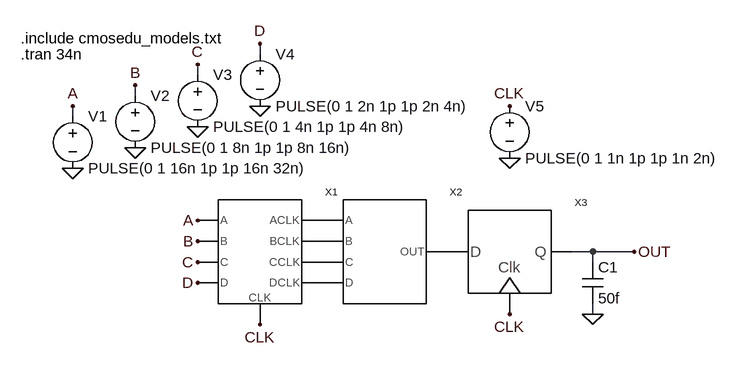
[diagram p0: schematic Circuit.asc]
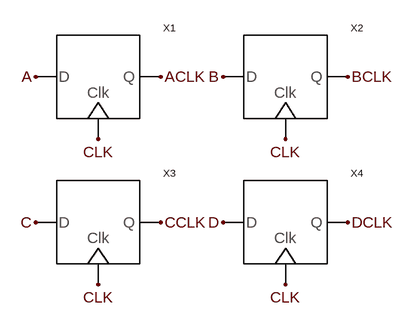
[diagram p1: sub-circuit d_ff4.asc]
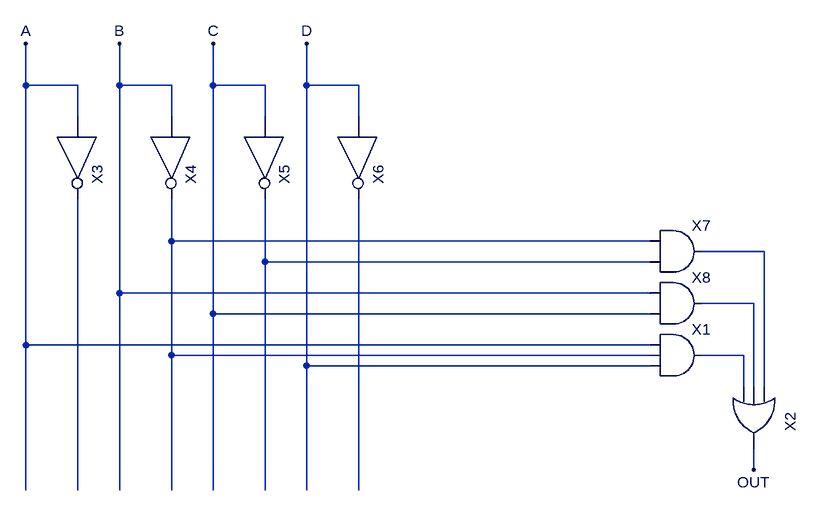
[diagram p2: sub-circuit fonction.asc]
Circuit.asc, the LTspice schematic file:
Version 4
SHEET 1 1228 680
WIRE 304 -96 304 -112
WIRE 208 -64 208 -80
WIRE 112 -32 112 -48
WIRE 16 0 16 -16
WIRE 816 208 784 208
WIRE 880 208 816 208
WIRE 816 224 816 208
WIRE 816 304 816 288
FLAG 112 48 0
FLAG 16 80 0
FLAG 208 16 0
FLAG 304 -16 0
FLAG 16 -16 A
FLAG 112 -48 B
FLAG 208 -80 C
FLAG 304 -112 D
FLAG 208 160 A
FLAG 208 192 B
FLAG 208 224 C
FLAG 208 256 D
FLAG 816 304 0
FLAG 688 64 0
FLAG 688 -16 CLK
FLAG 304 320 CLK
FLAG 688 304 CLK
FLAG 880 208 OUT
SYMBOL D_FF4 304 208 R0
SYMATTR InstName X1
SYMBOL voltage 16 -16 R0
WINDOW 123 0 0 Left 0
WINDOW 39 0 0 Left 0
SYMATTR InstName V1
SYMATTR Value PULSE(0 1 16n 1p 1p 16n 32n)
SYMBOL voltage 112 -48 R0
WINDOW 123 0 0 Left 0
WINDOW 39 0 0 Left 0
SYMATTR InstName V2
SYMATTR Value PULSE(0 1 8n 1p 1p 8n 16n)
SYMBOL voltage 208 -80 R0
WINDOW 123 0 0 Left 0
WINDOW 39 0 0 Left 0
SYMATTR InstName V3
SYMATTR Value PULSE(0 1 4n 1p 1p 4n 8n)
SYMBOL voltage 304 -112 R0
WINDOW 123 0 0 Left 0
WINDOW 39 0 0 Left 0
SYMATTR InstName V4
SYMATTR Value PULSE(0 1 2n 1p 1p 2n 4n)
SYMBOL Fonction 496 208 R0
SYMATTR InstName X2
SYMBOL D_FF 688 208 R0
SYMATTR InstName X3
SYMBOL voltage 688 -32 R0
WINDOW 123 0 0 Left 0
WINDOW 39 0 0 Left 0
SYMATTR InstName V5
SYMATTR Value PULSE(0 1 1n 1p 1p 1n 2n)
SYMBOL cap 800 224 R0
SYMATTR InstName C1
SYMATTR Value 50f
TEXT -64 -120 Left 2 !.include cmosedu_models.txt
TEXT -64 -96 Left 2 !.tran 34n

d_ff4.asc, the sub-circuit schematic file:
Version 4
SHEET 1 880 972
FLAG -144 640 CLK
FLAG 144 640 CLK
FLAG -144 864 CLK
FLAG 144 864 CLK
FLAG -240 544 A
FLAG 48 544 B
FLAG -240 768 C
FLAG 48 768 D
FLAG -48 544 ACLK
FLAG 240 544 BCLK
FLAG -48 768 CCLK
FLAG 240 768 DCLK
SYMBOL D_FF -144 544 R0
SYMATTR InstName X1
SYMBOL D_FF 144 544 R0
SYMATTR InstName X2
SYMBOL D_FF -144 768 R0
SYMATTR InstName X3
SYMBOL D_FF 144 768 R0
SYMATTR InstName X4

fonction.asc, the sub-circuit schematic file:
Version 4
SHEET 1 884 680
WIRE -368 -80 -368 -144
WIRE -288 -80 -368 -80
WIRE -224 -80 -224 -144
WIRE -144 -80 -224 -80
WIRE -80 -80 -80 -144
WIRE 0 -80 -80 -80
WIRE 64 -80 64 -144
WIRE 144 -80 64 -80
WIRE -288 -32 -288 -80
WIRE -144 -32 -144 -80
WIRE 0 -32 0 -80
WIRE 144 -32 144 -80
WIRE -144 160 -144 96
WIRE 592 160 -144 160
WIRE 768 176 672 176
WIRE 0 192 0 96
WIRE 592 192 0 192
WIRE -224 240 -224 -80
WIRE 592 240 -224 240
WIRE 752 256 672 256
WIRE -80 272 -80 -80
WIRE 592 272 -80 272
WIRE -368 320 -368 -80
WIRE 592 320 -368 320
WIRE -144 336 -144 160
WIRE 592 336 -144 336
WIRE 736 336 672 336
WIRE 64 352 64 -80
WIRE 592 352 64 352
WIRE 736 384 736 336
WIRE 752 384 752 256
WIRE 768 384 768 176
WIRE 752 512 752 480
WIRE -368 544 -368 320
WIRE -288 544 -288 96
WIRE -224 544 -224 240
WIRE -144 544 -144 336
WIRE -80 544 -80 272
WIRE 0 544 0 192
WIRE 64 544 64 352
WIRE 144 544 144 96
FLAG 752 512 OUT
FLAG -368 -144 A
FLAG -224 -144 B
FLAG -80 -144 C
FLAG 64 -144 D
SYMBOL AND3 640 272 R0
SYMATTR InstName X1
SYMBOL OR3 816 432 R90
SYMATTR InstName X2
SYMBOL NOT -256 0 R90
SYMATTR InstName X3
SYMBOL NOT -112 0 R90
SYMATTR InstName X4
SYMBOL NOT 32 0 R90
SYMATTR InstName X5
SYMBOL NOT 176 0 R90
SYMATTR InstName X6
SYMBOL AND2 640 112 R0
SYMATTR InstName X7
SYMBOL AND2 640 192 R0
SYMATTR InstName X8

The netlist it stands for:
* Circuit.asc
XX1 A B C D P001 P002 P003 P004 CLK d_ff4
V1 A 0 PULSE(0 1 16n 1p 1p 16n 32n)
V2 B 0 PULSE(0 1 8n 1p 1p 8n 16n)
V3 C 0 PULSE(0 1 4n 1p 1p 4n 8n)
V4 D 0 PULSE(0 1 2n 1p 1p 2n 4n)
XX2 P004 P003 P002 P001 P005 fonction
XX3 P005 OUT CLK D_FF  ; pins D Q clock
V5 CLK 0 PULSE(0 1 1n 1p 1p 1n 2n)
C1 OUT 0 50f

* block symbol definitions
.subckt d_ff4 A B C D DCLK CCLK BCLK ACLK CLK
XX1 A ACLK CLK D_FF  ; pins D Q clock
XX2 B BCLK CLK D_FF  ; pins D Q clock
XX3 C CCLK CLK D_FF  ; pins D Q clock
XX4 D DCLK CLK D_FF  ; pins D Q clock
.ends d_ff4

.subckt fonction A B C D OUT
XX1 A D N005 N001 AND3  ; pins In1 In3 Out In2
XX2 N002 N004 N005 OUT OR3  ; pins In1 In2 In3 Out
XX3 A N006 NOT  ; pins In Out
XX4 B N001 NOT  ; pins In Out
XX5 C N003 NOT  ; pins In Out
XX6 D N007 NOT  ; pins In Out
XX7 N001 N003 N002 AND2  ; pins In1 In2 Out
XX8 B C N004 AND2  ; pins In1 In2 Out
.ends fonction

.include cmosedu_models.txt
.tran 34n
.backanno
.end

* Results of the author's LTspice run, read from the files saved beside the schematic
* Operating Point, zero values left out:
*   V(p004) = 76.04 µV
*   V(p003) = 77.35 µV
*   V(p002) = 76.04 µV
*   V(p001) = 78.01 µV
*   V(p005) = 999.9 mV
*   V(out) = 1 V
*   I(V5) = 185 nA
*   I(V4) = 31.04 nA
*   I(V3) = 31.04 nA
*   I(V2) = 31.04 nA
*   I(V1) = 31.04 nA
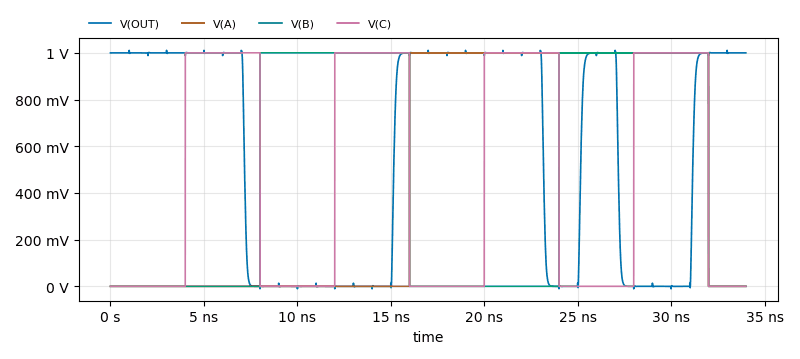
[diagram p3: Transient Analysis of Circuit.asc, plotted from the saved traces]
* Transient Analysis, 1 run:
*   V(OUT): min -10.63 mV, max 1.011 V, average 589.3 mV, rms 761.5 mV, last 1 V
*   V(A): min 0 V, max 1 V, average 470.6 mV, rms 686 mV, last 0 V
*   V(B): min 0 V, max 1 V, average 470.6 mV, rms 686 mV, last 0 V
*   V(C): min 0 V, max 1 V, average 470.7 mV, rms 686.1 mV, last 0 V